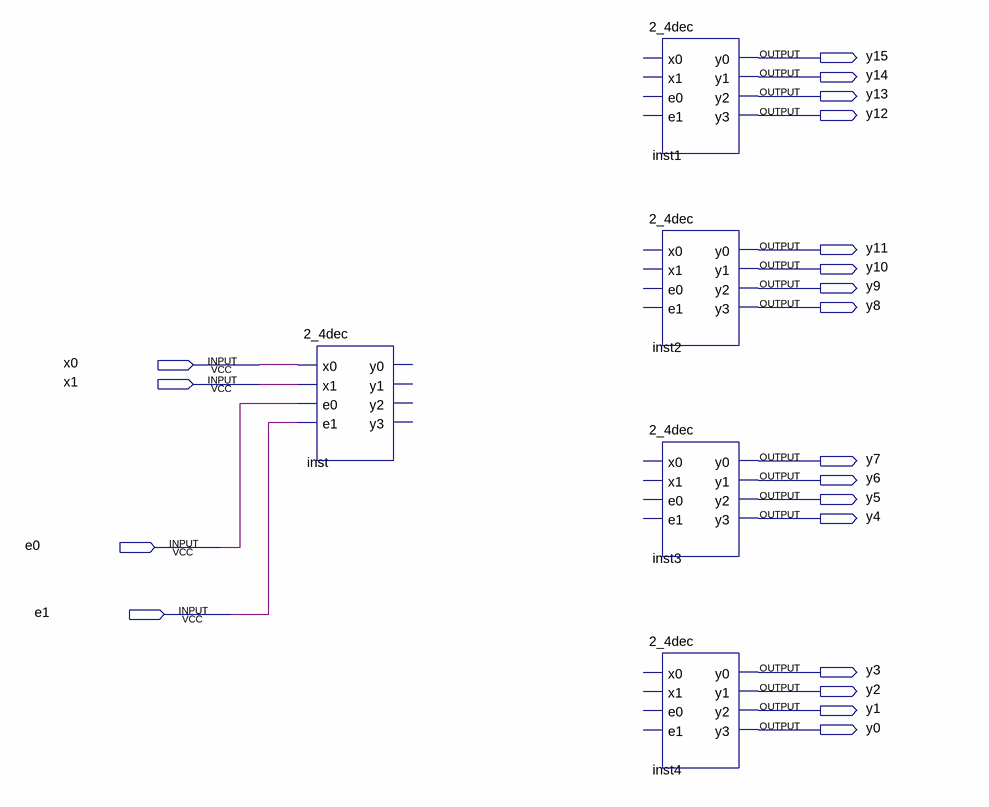
[diagram p0: schematic sheet]
// Quartus schematic Dec4_16.bdf as structural Verilog: 5 symbols, 20 pins
module Dec4_16 (
  input  x0,
  input  x1,
  input  e0,
  input  e1,
  output y15,
  output y14,
  output y13,
  output y12,
  output y11,
  output y10,
  output y9,
  output y8,
  output y7,
  output y6,
  output y5,
  output y4,
  output y3,
  output y2,
  output y1,
  output y0
);

  \2_4dec  inst (.x0(x0), .x1(x1), .e0(e0), .e1(e1));  // open: y0, y1, y2, y3
  \2_4dec  inst1 (.y0(y15), .y1(y14), .y2(y13), .y3(y12));  // open: x0, x1, e0, e1
  \2_4dec  inst2 (.y0(y11), .y1(y10), .y2(y9), .y3(y8));  // open: x0, x1, e0, e1
  \2_4dec  inst3 (.y0(y7), .y1(y6), .y2(y5), .y3(y4));  // open: x0, x1, e0, e1
  \2_4dec  inst4 (.y0(y3), .y1(y2), .y2(y1), .y3(y0));  // open: x0, x1, e0, e1
endmodule
